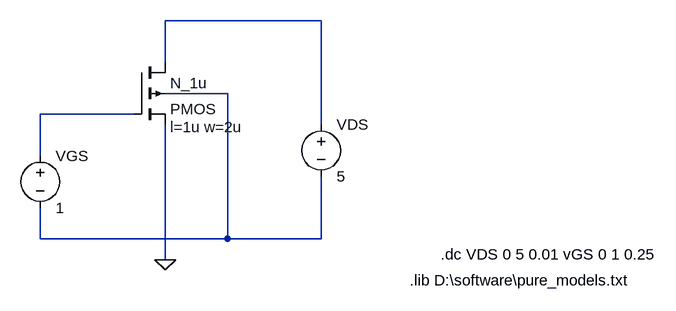
[diagram p0: schematic Nmos lc.asc]
Nmos lc.asc, the LTspice schematic file:
Version 4
SHEET 1 944 680
WIRE 416 32 176 32
WIRE 176 96 176 32
WIRE 272 144 176 144
WIRE 128 176 -16 176
WIRE 416 192 416 32
WIRE -16 240 -16 176
WIRE -16 368 -16 320
WIRE 272 368 272 144
WIRE 272 368 -16 368
WIRE 416 368 416 272
WIRE 416 368 272 368
WIRE 176 400 176 192
FLAG 176 400 0
SYMBOL pmos4 128 96 R0
WINDOW 123 56 100 Left 2
SYMATTR InstName N_1u
SYMATTR Value2 l=1u w=2u
SYMBOL voltage 416 176 R0
WINDOW 123 0 0 Left 0
WINDOW 39 0 0 Left 0
SYMATTR InstName VDS
SYMATTR Value 5
SYMBOL voltage -16 224 R0
WINDOW 123 0 0 Left 0
WINDOW 39 0 0 Left 0
SYMATTR InstName VGS
SYMATTR Value 1
TEXT 552 432 Left 2 !.lib D:\\software\\pure_models.txt
TEXT 600 392 Left 2 !.dc VDS 0 5 0.01 vGS 0 1 0.25

The netlist it stands for:
* Nmos lc.asc
M§N_1u N001 N003 0 N002 PMOS l=1u w=2u
VDS N001 N002 5
VGS N003 N002 1
.model NMOS NMOS
.model PMOS PMOS
.lib standard.mos
.lib D:\software\pure_models.txt
.dc VDS 0 5 0.01 vGS 0 1 0.25
.backanno
.end